# EAGLE design akabeacon (EAGLE 7.2.0)
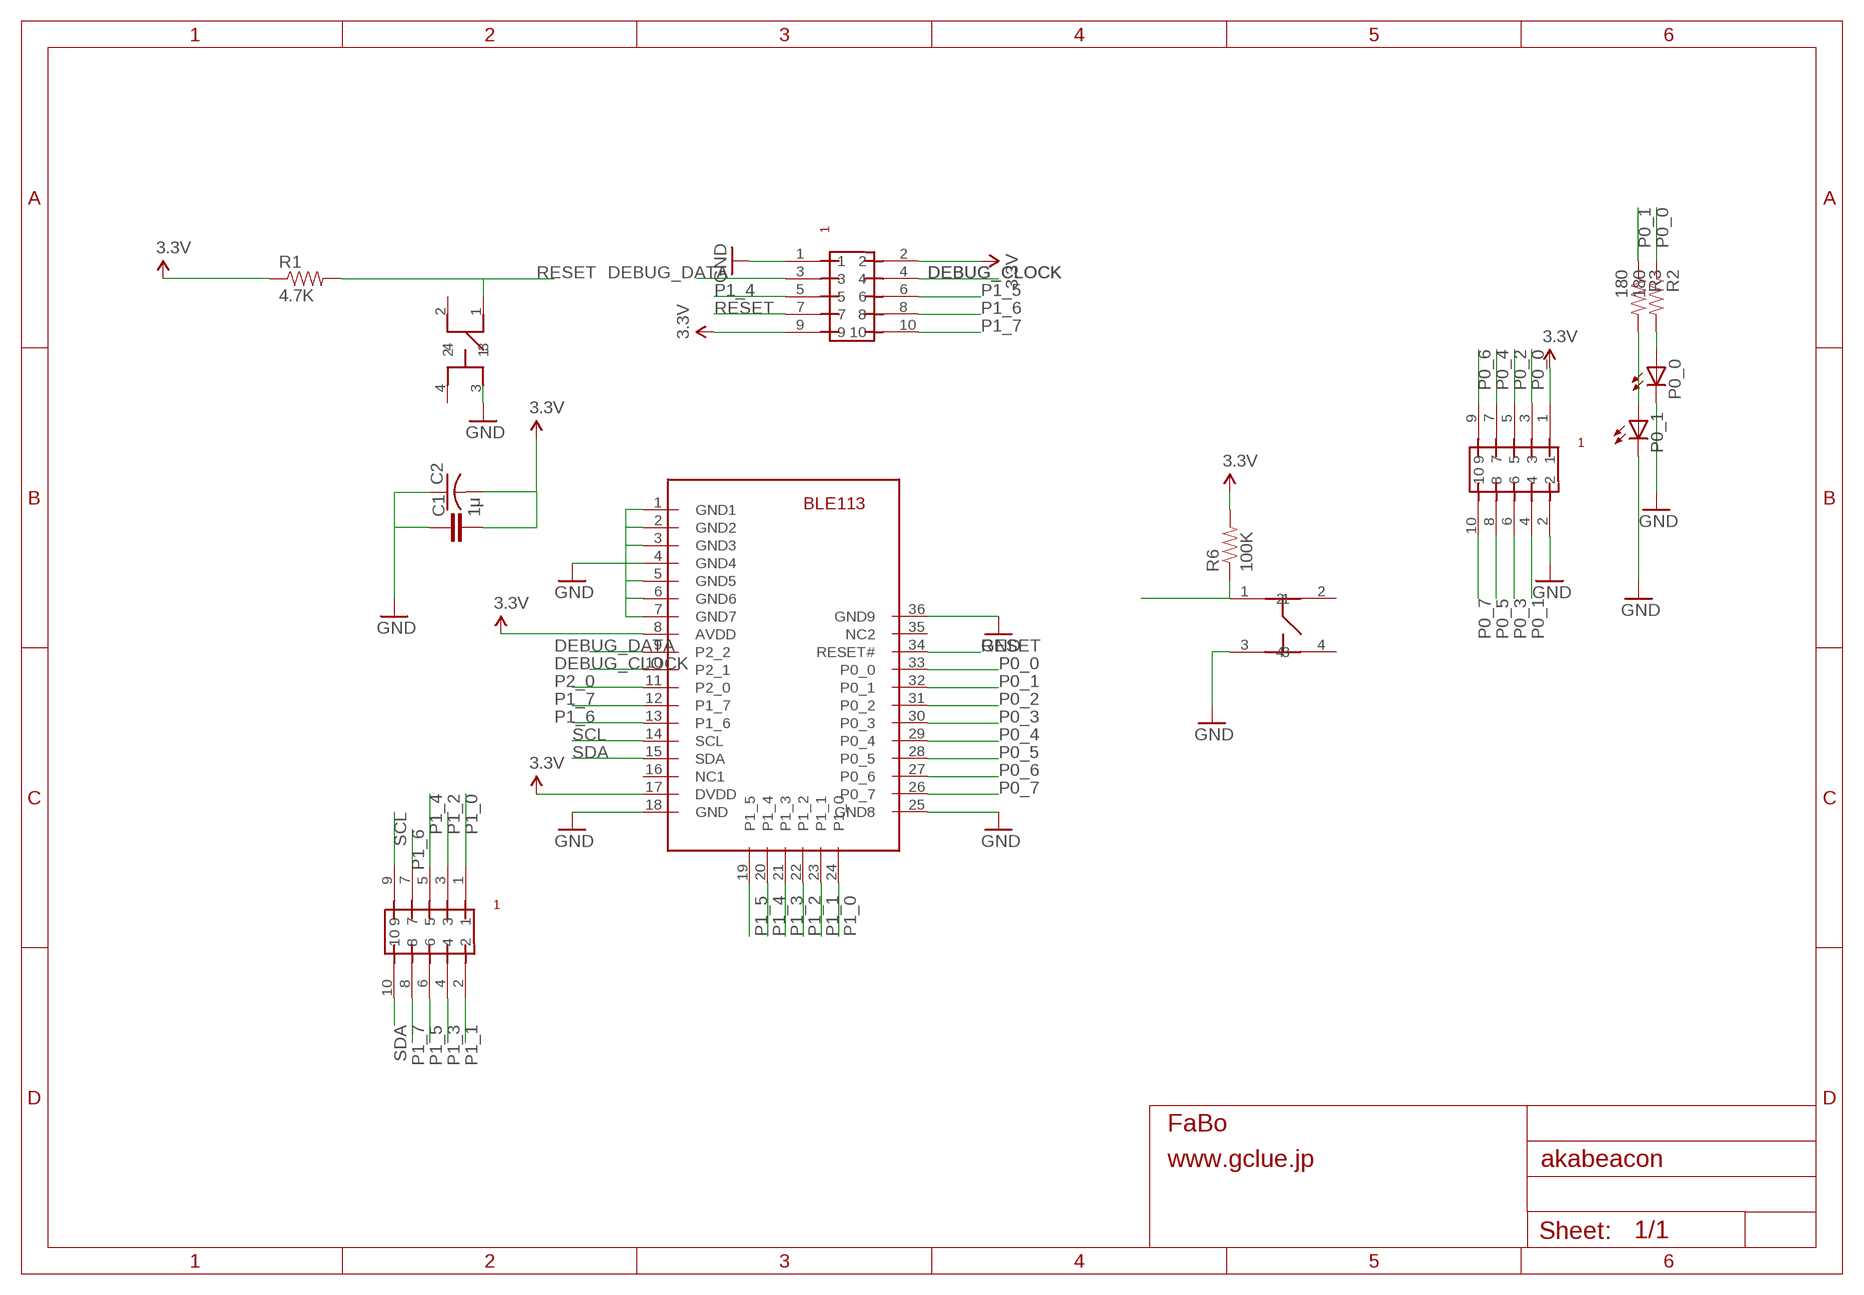
[diagram p0: schematic, sheet 1]

## Parts
C1  1μ  CAP0603-CAP  [0603-CAP]
C2  C-USC3225  [C3225]
P0_0  LEDCHIP-LED0603  [CHIP-LED0603]
P0_1  LEDCHIP-LED0603  [CHIP-LED0603]
R1  4.7K  RESISTOR0603-RES  [0603-RES]
R2  180  RESISTOR0603-RES  [0603-RES]
R3  180  RESISTOR0603-RES  [0603-RES]
R6  100K  RESISTOR0603-RES  [0603-RES]
U$1  SWICTH-4P(KMR2)  [SWITCH-4P(KMR2)]
U$2  PIN-HEADER-SMT(1.27MM)2X5  [PIN-HEADER-SMT(1.27MM)2X5]
U$3  PIN-HEADER-SMT(1.27MM)2X5  [PIN-HEADER-SMT(1.27MM)2X5]
U$4  PIN-HEADER-SMT(1.27MM)2X5  [PIN-HEADER-SMT(1.27MM)2X5]
U$5  BLE113  [BLE113]
U$8  SWITCH-LS6J2M-T  [SWICTH-LS6J2M-T]

## Nets
3.3V: C1.2 C2.2 R1.1 R6.2 U$2.2 U$2.9 U$4.1 U$5.8(AVDD) U$5.17(DVDD)
DEBUG_CLOCK: U$2.4 U$5.10(P2_1)
DEBUG_DATA: U$2.3 U$5.9(P2_2)
GND: C1.1 C2.1 P0_0.C P0_1.C U$1.3 U$2.1 U$4.2 U$5.1(GND1) U$5.2(GND2) U$5.3(GND3) U$5.4(GND4) U$5.5(GND5) U$5.6(GND6) U$5.7(GND7) U$5.18(GND) U$5.25(GND8) U$5.36(GND9) U$8.3
N$2: P0_0.A R2.2
N$3: P0_1.A R3.2
P0_0: R2.1 U$4.3 U$5.33(P0_0)
P0_1: R3.1 U$4.4 U$5.32(P0_1)
P0_2: U$4.5 U$5.31(P0_2)
P0_3: U$4.6 U$5.30(P0_3)
P0_4: U$4.7 U$5.29(P0_4)
P0_5: U$4.8 U$5.28(P0_5)
P0_6: U$4.9 U$5.27(P0_6)
P0_7: U$4.10 U$5.26(P0_7)
P0_8: R6.1 U$1.1
P1_0: U$3.1 U$5.24(P1_0)
P1_1: U$3.2 U$5.23(P1_1)
P1_2: U$3.3 U$5.22(P1_2)
P1_3: U$3.4 U$5.21(P1_3)
P1_4: U$2.5 U$3.5 U$5.20(P1_4)
P1_5: U$2.6 U$3.6 U$5.19(P1_5)
P1_6: U$2.8 U$3.7 U$5.13(P1_6)
P1_7: U$2.10 U$3.8 U$5.12(P1_7)
P2_0: U$5.11(P2_0)
RESET: R1.2 U$2.7 U$5.34(RESET#) U$8.1
SCL: U$3.9 U$5.14(SCL)
SDA: U$3.10 U$5.15(SDA)
Unconnected: U$1.2 U$1.4 U$5.16(NC1) U$5.35(NC2) U$8.2 U$8.4

## Library data of the parts
C1 = SparkFun:CAP: Capacitor Standard 0603 ceramic capacitor, and 0.1" leaded capacitor.
C2 = rcl:C-US: CAPACITOR, American symbol
P0_0 P0_1 = led:LED: LED OSRAM: - CHIPLED LG R971, LG N971, LY N971, LG Q971, LY Q971, LO R971, LY R971 LH N974, LH R974 LS Q976, LO Q976, LY Q976 LO Q996 - Hyper CHIPLED LW Q18S LB Q993, LB Q99A, LB R99A - SideLED LS A670, LO A670, LY A670, LG A670, LP A670 LB A673, LV A673, LT A673, LW A673 LH A674 LY A675 LS A676, LA A676, LO A676, LY A676, LW A676 LS A679, LY A679, LG A679 - Hyper Micro SIDELED® LS Y876, LA Y876, LO Y876, LY Y876 LT Y87S - SmartLED LW L88C, LW L88S LB L89C, LB L89S, LG L890 LS L89K, LO L89K, LY L89K LS L896, LA L896, LO L896, LY L896 - TOPLED LS T670, LO T670, LY T670, LG T670, LP T670 LSG T670, LSP T670, LSY T670, LOP T670, LYG T670 LG T671, LOG T671, LSG T671 LB T673, LV T673, LT T673, LW T673 LH T674 LS T676, LA T676, LO T676, LY T676, LB T676, LH T676, LSB T676, LW T676 LB T67C, LV T67C, LT T67C, LS T67K, LO T67K, LY T67K, LW E67C LS E67B, LA E67B, LO E67B, LY E67B, LB E67C, LV E67C, LT E67C LW T67C LS T679, LY T679, LG T679 LS T770, LO T770, LY T770, LG T770, LP T770 LB T773, LV T773, LT T773, LW T773 LH T774 LS E675, LA E675, LY E675, LS T675 LS T776, LA T776, LO T776, LY T776, LB T776 LHGB T686 LT T68C, LB T68C - Hyper Mini TOPLED® LB M676 - Mini TOPLED Santana® LG M470 LS M47K, LO M47K, LY M47K Source: http://www.osram.convergy.de LUXEON: - LUMILED® LXK2-PW12-R00, LXK2-PW12-S00, LXK2-PW14-U00, LXK2-PW14-V00 LXK2-PM12-R00, LXK2-PM12-S00, LXK2-PM14-U00 LXK2-PE12-Q00, LXK2-PE12-R00, LXK2-PE12-S00, LXK2-PE14-T00, LXK2-PE14-U00 LXK2-PB12-K00, LXK2-PB12-L00, LXK2-PB12-M00, LXK2-PB14-N00, LXK2-PB14-P00, LXK2-PB14-Q00 LXK2-PR12-L00, LXK2-PR12-M00, LXK2-PR14-Q00, LXK2-PR14-R00 LXK2-PD12-Q00, LXK2-PD12-R00, LXK2-PD12-S00 LXK2-PH12-R00, LXK2-PH12-S00 LXK2-PL12-P00, LXK2-PL12-Q00, LXK2-PL12-R00 Source: www.luxeon.com KINGBRIGHT: KA-3528ASYC Source: www.kingbright.com
R1-R3 R6 = SparkFun:RESISTOR: Resistor Basic schematic elements and footprints for 0603, 1206, and PTH resistors.
U$1 = gclue-test:SWICTH-4P(KMR2)
U$2-U$4 = gclue:PIN-HEADER-SMT(1.27MM)2X5: PIN-HEADER-SMT (1.27MM) 2x5
U$5 = gclue:BLE113
U$8 = gclue:SWITCH-LS6J2M-T

## Board
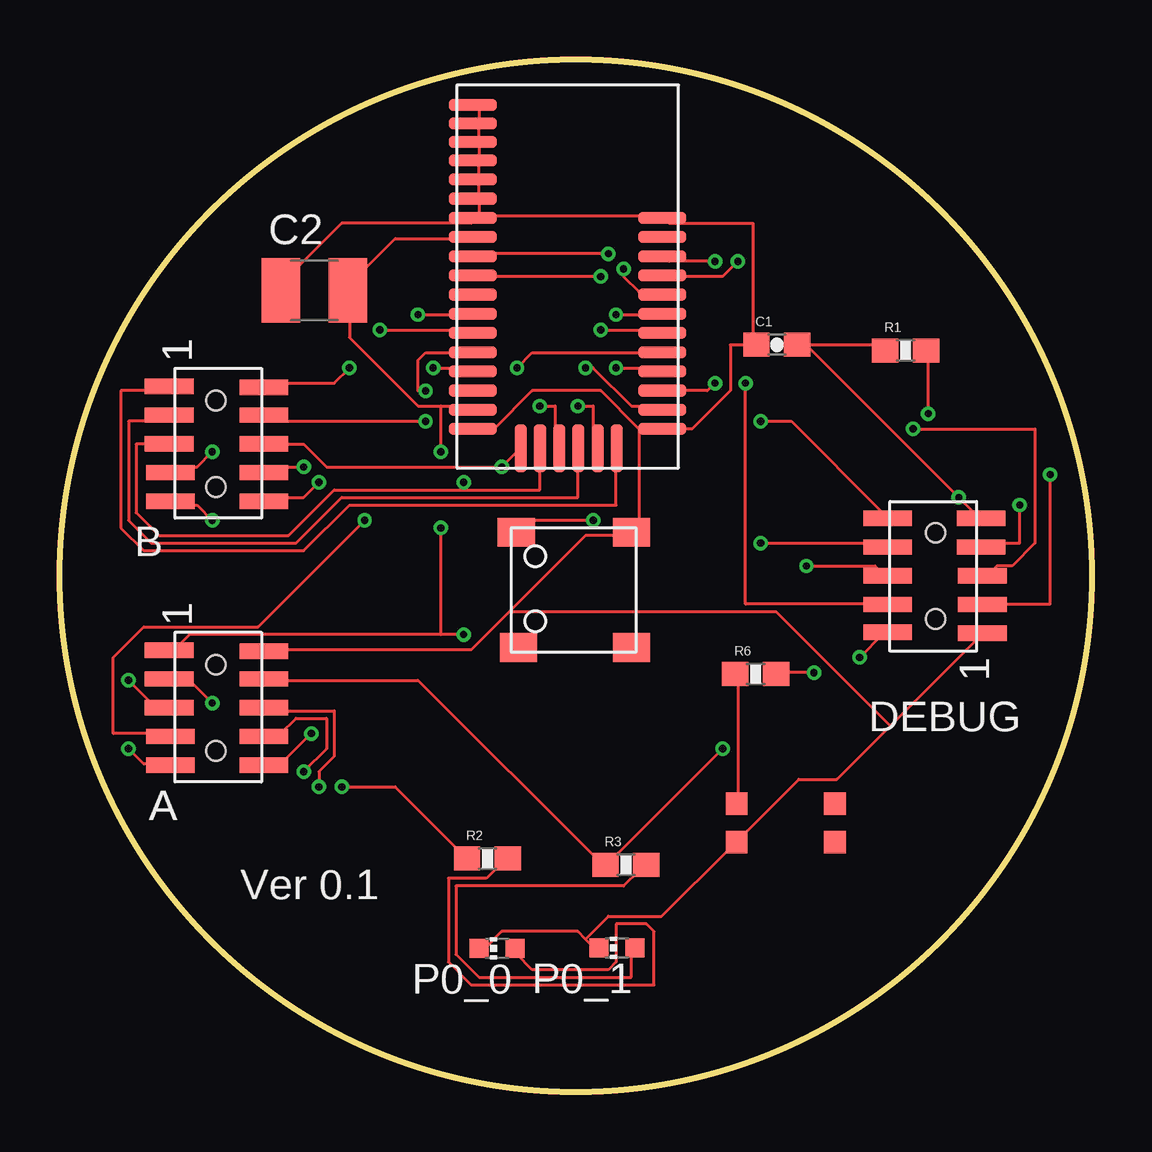
[diagram p1: board, top side]
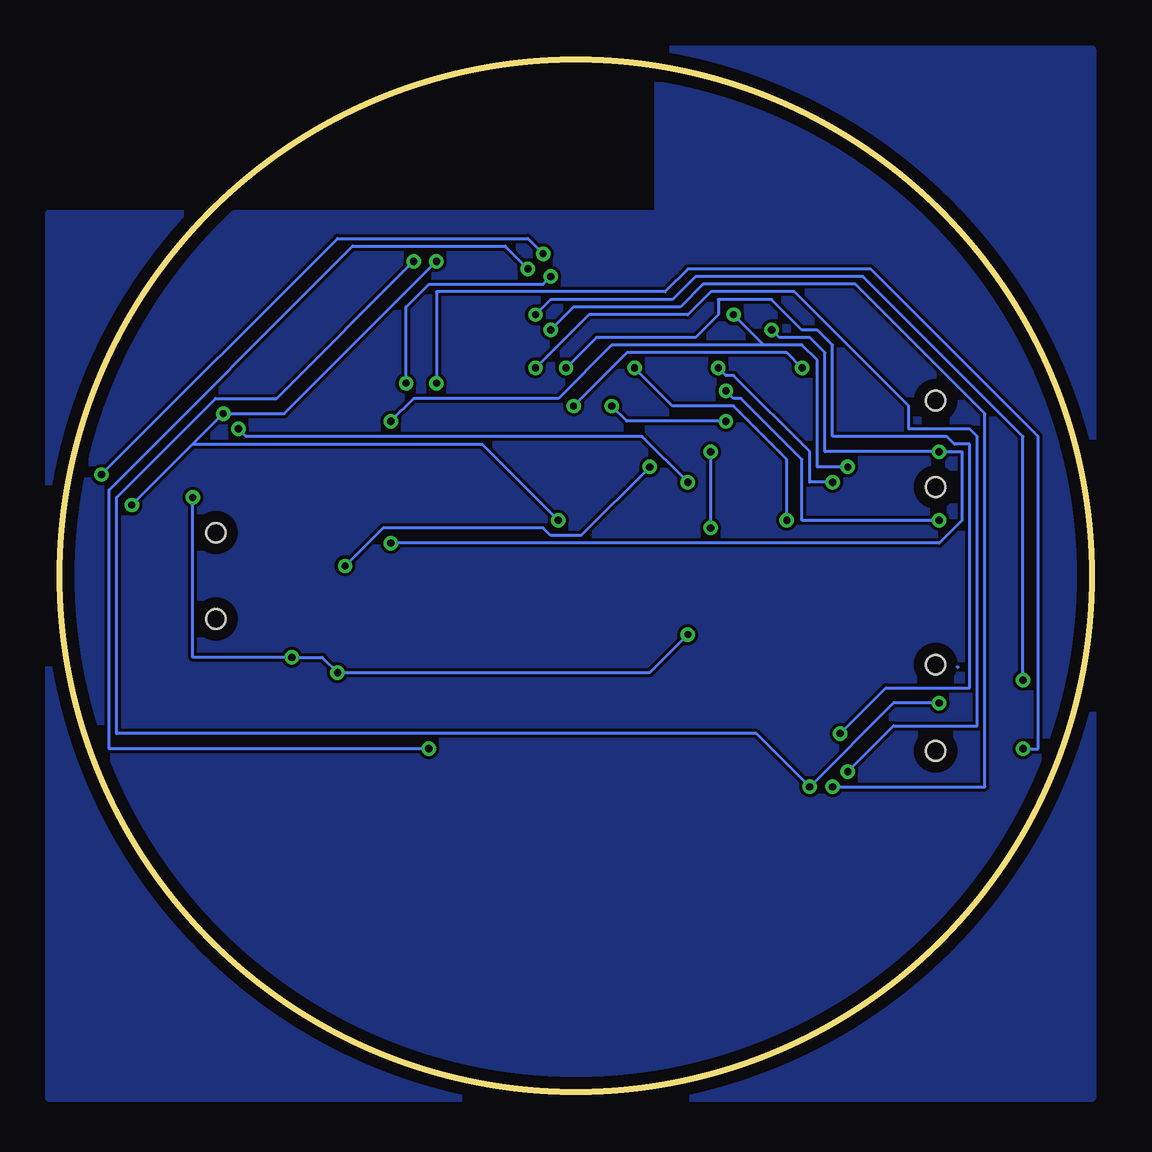
[diagram p2: board, bottom side, seen from below]

Size 43 x 43 mm. Coordinates in mm from the lower left corner, seen from the top.
Outline: circle at 21.5,21.5 radius 21.5
Copper layers (1+2*15+16): Top 0.018mm / dielectric 0.25mm / Route2 0.035mm / dielectric 1mm / Route15 0.035mm / dielectric 0.25mm / Bottom 0.018mm
Design rules "pban_5mil-l4": minimum track width 5mil, minimum drill 0.3mm, track to track 5mil, track to pad 0.229mm, pad to pad 5mil, via to via 5mil, smd to smd 5mil, copper to edge 0.5mm, drill to drill 0.5mm, minimum pad ring 0.15mm, minimum via ring 0.15mm, stop-mask expansion 4mil, vias tented up to drill 0.35mm, thermal gap 10mil

### Footprints (pad centres in the part's own frame; a part is rotated, then mirrored left to right if it is on the bottom)
0603-CAP = smd 1.1 x 1: 1 -0.85,0; 2 0.85,0
C3225 = smd 1.6 x 2.7: 1 -1.4,0; 2 1.4,0
CHIP-LED0603 = smd 0.8 x 0.8: A 0,-0.75; C 0,0.75
0603-RES = smd 1.1 x 1: 1 -0.85,0; 2 0.85,0
SWITCH-4P(KMR2) = smd 0.9 x 0.95: 1 -1,0; 2 3.1,0; 3 -1,-1.6; 4 3.1,-1.6
PIN-HEADER-SMT(1.27MM)2X5 = smd 0.635 x 2.032: 1 -2.4,-1.95; 2 -2.35,2; 3 -1.2,-1.95; 4 -1.2,2; 5 0,-1.95; 6 0,2; 7 1.2,-1.9; 8 1.2,2; 9 2.4,-1.9; 10 2.4,2 | hole 0.8: 1.8,0; -1.8,0
BLE113 = smd 2 x 0.5: 1 -5.08,5.08; 2 -5.08,4.31; 3 -5.08,3.54; 4 -5.08,2.77; 5 -5.08,1.97; 6 -5.08,1.17; 7 -5.08,0.37; 8 -5.08,-0.43; 9 -5.08,-1.23; 10 -5.08,-2.03; 11 -5.08,-2.83; 12 -5.08,-3.63; 13 -5.08,-4.43; 14 -5.08,-5.23; 15 -5.08,-6.03; 16 -5.08,-6.83; 17 -5.08,-7.63; 18 -5.08,-8.43; 25 2.82,-8.43; 26 2.82,-7.63; 27 2.82,-6.83; 28 2.82,-6.03; 29 2.82,-5.23; 30 2.82,-4.43; 31 2.82,-3.63; 32 2.82,-2.83; 33 2.82,-2.03; 34 2.82,-1.23; 35 2.82,-0.43; 36 2.82,0.37 | smd 0.5 x 2: 19 -3.08,-9.23; 20 -2.28,-9.23; 21 -1.48,-9.23; 22 -0.68,-9.23; 23 0.12,-9.23; 24 0.92,-9.23
SWICTH-LS6J2M-T = smd 1.55 x 1.2: 1 -2.4,2.4; 2 -2.3,-2.4; 3 2.4,2.4; 4 2.4,-2.4

### Placement (x,y rotation side)
C1  29.88,31.13 0 top
C2  10.6,33.4 0 top
P0_0  18.22,5.97 90 top
P0_1  23.22,5.99 90 top
R1  35.25,30.89 0 top
R2  17.82,9.71 0 top
R3  23.59,9.45 0 top
R6  29,17.4 0 top
U$1  29.2,12 0 top
U$2  36.5,21.5 90 top
U$3  6.5,27 270 top
U$4  6.5,16 270 top
U$5  22.29,36.05 0 top
U$8  21.42,20.91 0 top

### Tracks (layer width: path | path; a pad name or v marks a point on that pad's centre or on a via)
3.3V  (via drill 0.3)
  Top 0.127: 31.11,31.11 34.29,31.11 R1.1 | 31.11,31.11 30.8,31.11 C1.2 31.11,31.11 | 31.11,31.11 v37.47,24.77 38.1,24.13 U$2.9 | 15.88,28.57 14.92,28.57 12.06,31.43 12.06,33.34 C2.2 12.06,33.66 13.97,35.56 17.14,35.56 U$5.8 | 15.88,28.57 17.14,28.57 U$5.17 | v31.43,17.46 30.16,17.46 R6.2 | v33.34,18.1 34.29,19.05 U$2.2 | v16.83,19.05 15.88,19.05 | 15.88,19.05 5.4,19.05 4.76,18.41 U$4.1 | v15.88,26.67 15.88,28.57 | 15.88,19.05 v15.88,23.5
  Bottom 0.127: v16.83,19.05 18.41,17.46 v31.43,17.46 32.07,18.1 v33.34,18.1 37.47,18.1 v37.47,24.77 | v15.88,23.5 v15.88,26.67
AGND
  Bottom 0.127: 5.6,17.7 5.56,17.68
DEBUG_CLOCK  (via drill 0.3)
  Top 0.127: v22.54,33.97 17.46,33.97 U$5.10 | v28.57,29.53 28.57,20.32 34.29,20.32 U$2.4
  Bottom 0.127: v22.54,33.97 22.86,33.66 27.62,33.66 28.57,32.7 v28.57,29.53
DEBUG_DATA  (via drill 0.3)
  Top 0.127: v22.86,34.92 17.46,34.92 U$5.9 | v41.27,25.72 41.27,20.32 38.73,20.32 U$2.3
  Bottom 0.127: v22.86,34.92 23.5,35.56 31.43,35.56 v41.27,25.72
GND
  Top 0.127: 21.91,6.35 22.23,6.03 P0_1.C | 21.91,6.35 21.59,6.67 18.41,6.67 17.78,6.03 P0_0.C | 21.91,6.35 22.86,7.3 25.08,7.3 27.94,10.16 U$1.3 28.26,10.48 30.8,13.02 32.38,13.02 34.61,15.24 | 34.61,15.24 38.42,19.05 U$2.1 | 24.13,27.62 24.13,23.5 U$8.3 23.81,23.18 21.91,23.18 18.73,20 | 24.13,27.62 25.08,27.62 U$5.25 | 24.13,27.62 22.54,29.21 19.68,29.21 18.1,27.62 17.46,27.62 U$5.18 | 24.13,27.62 U$5.25 | 18.73,20 17.14,18.41 8.57,18.41 U$4.2 | 17.46,40.32 17.46,40.96 U$5.1 | 17.46,36.51 17.46,37.15 U$5.6 17.46,37.47 17.46,37.78 U$5.5 17.46,38.1 17.46,38.73 U$5.4 17.46,39.05 17.46,39.37 U$5.3 17.46,39.69 17.46,40.32 | 17.46,40.32 U$5.2 | C2.1 9.21,33.66 11.75,36.2 17.14,36.2 U$5.7 17.46,36.51 | 17.46,36.51 25.08,36.51 U$5.36 25.4,36.2 28.89,36.2 28.89,31.43 C1.1 28.89,31.11 27.94,31.11 27.94,29.21 26.35,27.62 25.4,27.62 U$5.25 | 34.61,15.24 29.84,20 18.73,20
N$1
  pour Bottom: 0,-0.25 43.43,-0.25 43.43,36.58 18.03,36.58 18.03,43.43 0,43.43
N$2
  Top 0.127: P0_0.A 19.05,5.71 19.68,5.08 22.86,5.08 23.18,5.4 23.18,6.99 24.45,6.99 24.77,6.67 24.77,4.45 17.14,4.45 16.19,5.4 16.19,8.89 17.78,8.89 18.41,9.53 R2.2
N$3
  Top 0.127: P0_1.A 23.81,5.71 23.81,4.76 17.46,4.76 16.51,5.71 16.51,8.57 23.5,8.57 24.13,9.21 R3.2
P0_0  (via drill 0.3)
  Top 0.127: v11.75,12.7 13.97,12.7 16.83,9.84 R2.1 | v6.35,16.19 5.4,17.14 4.76,17.14 U$4.3 | v28.26,34.61 27.62,33.97 25.4,33.97 U$5.33
  Bottom 0.127: v6.35,16.19 8.26,16.19 v11.75,12.7 13.97,14.92 40.64,14.92 40.64,24.77 36.51,28.89 33.97,28.89 v28.26,34.61
P0_1  (via drill 0.3)
  Top 0.127: U$4.4 8.57,17.14 14.92,17.14 22.54,9.53 R3.1 22.86,9.53 v27.62,14.29 | v23.5,34.29 23.5,33.97 24.13,33.34 25.08,33.34 U$5.32
  Bottom 0.127: v23.5,34.29 24.45,35.24 30.8,35.24 40.96,25.08 40.96,14.29 v27.62,14.29
P0_2  (via drill 0.3)
  Top 0.127: v23.18,32.38 25.08,32.38 U$5.31 | v2.86,17.14 3.81,16.19 4.45,16.19 U$4.5
  Bottom 0.127: v23.18,32.38 22.54,33.02 17.46,33.02 16.51,33.97 9.53,33.97 2.86,27.3 v2.86,17.14
P0_3  (via drill 0.3)
  Top 0.127: v22.54,31.75 25.08,31.75 U$5.30 | v10.79,12.7 10.79,13.34 11.43,13.97 11.43,15.88 8.57,15.88 U$4.6
  Bottom 0.127: v22.54,31.75 21.59,32.7 17.14,32.7 16.19,33.66 9.84,33.66 4.45,28.26 4.45,12.7 v10.79,12.7
P0_4  (via drill 0.3)
  Top 0.127: v19.05,30.16 19.68,30.8 25.08,30.8 U$5.29 | v12.7,23.81 8.26,19.37 3.49,19.37 2.22,18.1 2.22,14.92 4.45,14.92 U$4.7
  Bottom 0.127: v19.05,30.16 17.46,28.57 14.92,28.57 12.7,26.35 v12.7,23.81
P0_5  (via drill 0.3)
  Top 0.127: v23.18,30.16 25.08,30.16 U$5.28 | v10.16,13.34 11.11,14.29 11.11,15.56 9.84,15.56 9.21,14.92 8.57,14.92 U$4.8
  Bottom 0.127: v23.18,30.16 20.95,32.38 16.83,32.38 15.88,33.34 12.38,33.34 7.62,28.57 7.62,27.62 5.08,27.62 4.76,27.3 4.76,15.24 8.26,15.24 v10.16,13.34
P0_6  (via drill 0.3)
  Top 0.127: v27.3,29.53 26.99,29.21 25.4,29.21 U$5.27 | v2.86,14.29 3.49,13.65 4.45,13.65 U$4.9
  Bottom 0.127: v27.3,29.53 27.3,33.34 17.78,33.34 16.83,34.29 9.21,34.29 2.22,27.3 2.22,14.29 v2.86,14.29
P0_7  (via drill 0.3)
  Top 0.127: v21.91,30.16 22.23,30.16 23.81,28.57 25.08,28.57 U$5.26 | v10.48,14.92 9.21,13.65 8.57,13.65 U$4.10
  Bottom 0.127: v21.91,30.16 20.64,31.43 16.51,31.43 15.56,32.38 15.56,33.02 13.34,33.02 12.06,31.75 11.43,31.75 10.79,31.11 10.79,27.3 6.03,27.3 5.71,26.99 5.08,26.99 5.08,16.83 8.57,16.83 v10.48,14.92
P0_8
  Top 0.127: U$1.1 28.26,12.06 28.26,17.14 R6.1
P1_0
  Top 0.127: U$5.24 23.18,26.67 23.18,24.45 12.06,24.45 10.16,22.54 3.49,22.54 2.54,23.5 2.54,29.21 4.45,29.21 U$3.1
P1_1  (via drill 0.3)
  Top 0.127: v21.59,28.57 22.23,28.57 22.23,26.99 U$5.23 | v12.06,30.16 11.43,29.53 8.57,29.53 U$3.2
  Bottom 0.127: v21.59,28.57 19.37,30.8 12.7,30.8 v12.06,30.16
P1_2
  Top 0.127: U$5.22 21.59,26.67 21.59,24.77 11.75,24.77 9.84,22.86 3.81,22.86 2.86,23.81 2.86,27.94 4.45,27.94 U$3.3
P1_3  (via drill 0.3)
  Top 0.127: v20,28.57 20.64,28.57 20.64,26.99 U$5.21 | v15.24,27.94 8.57,27.94 U$3.4
  Bottom 0.127: v20,28.57 19.37,27.94 v15.24,27.94
P1_4  (via drill 0.3)
  Top 0.127: 16.83,25.08 11.43,25.08 9.53,23.18 4.13,23.18 3.17,24.13 3.17,26.99 4.45,26.99 U$3.5 | 16.83,25.08 20,25.08 20,26.67 U$5.20 | v35.56,27.62 40.64,27.62 40.64,22.86 39.69,21.91 39.05,21.91 38.73,21.59 U$2.5 | 16.83,25.08 v16.83,25.4
  Bottom 0.127: v35.56,27.62 35.24,27.3 18.73,27.3 v16.83,25.4
P1_5  (via drill 0.3)
  Top 0.127: U$5.19 19.05,26.67 v18.41,26.04 11.11,26.04 10.16,26.99 8.57,26.99 U$3.6 | v31.11,21.91 33.97,21.91 34.29,21.59 U$2.6
  Bottom 0.127: v31.11,21.91 29.53,23.5 22.86,23.5 22.54,23.18 21.27,23.18 v18.41,26.04
P1_6  (via drill 0.3)
  Top 0.127: v13.34,31.75 17.14,31.75 U$5.13 | v6.35,26.67 5.71,26.04 4.76,26.04 U$3.7 | v29.21,22.86 34.29,22.86 U$2.8
  Bottom 0.127: v13.34,31.75 13.02,31.43 11.75,31.43 11.11,30.8 11.11,26.67 v6.35,26.67 5.4,26.67 5.4,23.81 6.35,22.86 v29.21,22.86
P1_7  (via drill 0.3)
  Top 0.127: v14.92,32.38 17.14,32.38 U$5.12 | v10.16,26.04 8.57,26.04 U$3.8 | v29.21,27.94 30.48,27.94 34.29,24.13 U$2.10
  Bottom 0.127: 13.65,31.11 v14.92,32.38 | 13.65,31.11 12.06,31.11 11.43,30.48 11.43,26.04 v10.16,26.04 | v29.21,27.94 28.26,28.89 22.23,28.89 20,31.11 13.65,31.11
RESET  (via drill 0.3)
  Top 0.127: v36.2,28.26 36.2,30.8 R1.2 | v40.01,24.45 40.01,22.86 38.42,22.86 U$2.7 | v22.23,23.81 19.37,23.81 19.05,23.5 U$8.1 | v27.3,34.61 25.4,34.61 U$5.34
  Bottom 0.127: v40.01,24.45 37.47,26.99 | 37.47,26.99 v36.2,28.26 33.66,28.26 v27.3,34.61 | v22.23,23.81 25.4,26.99 37.47,26.99
SCL  (via drill 0.3)
  Top 0.127: v15.24,29.21 14.92,29.21 14.92,30.48 15.24,30.8 17.14,30.8 U$5.14 | v6.35,23.81 5.71,24.45 4.76,24.45 U$3.9
  Bottom 0.127: v15.24,29.21 14.92,28.89 14.61,28.89 12.06,26.35 12.06,23.81 v6.35,23.81
SDA  (via drill 0.3)
  Top 0.127: v15.56,30.16 17.14,30.16 U$5.15 | v10.79,25.4 10.16,24.77 8.57,24.77 U$3.10
  Bottom 0.127: v15.56,30.16 15.24,29.84 14.92,29.84 11.75,26.67 11.75,25.4 v10.79,25.4

### Text on the board
tPlace: B | DEBUG | A | A | Ver 0.1